# EAGLE design imu_junction (EAGLE 6.5.0)
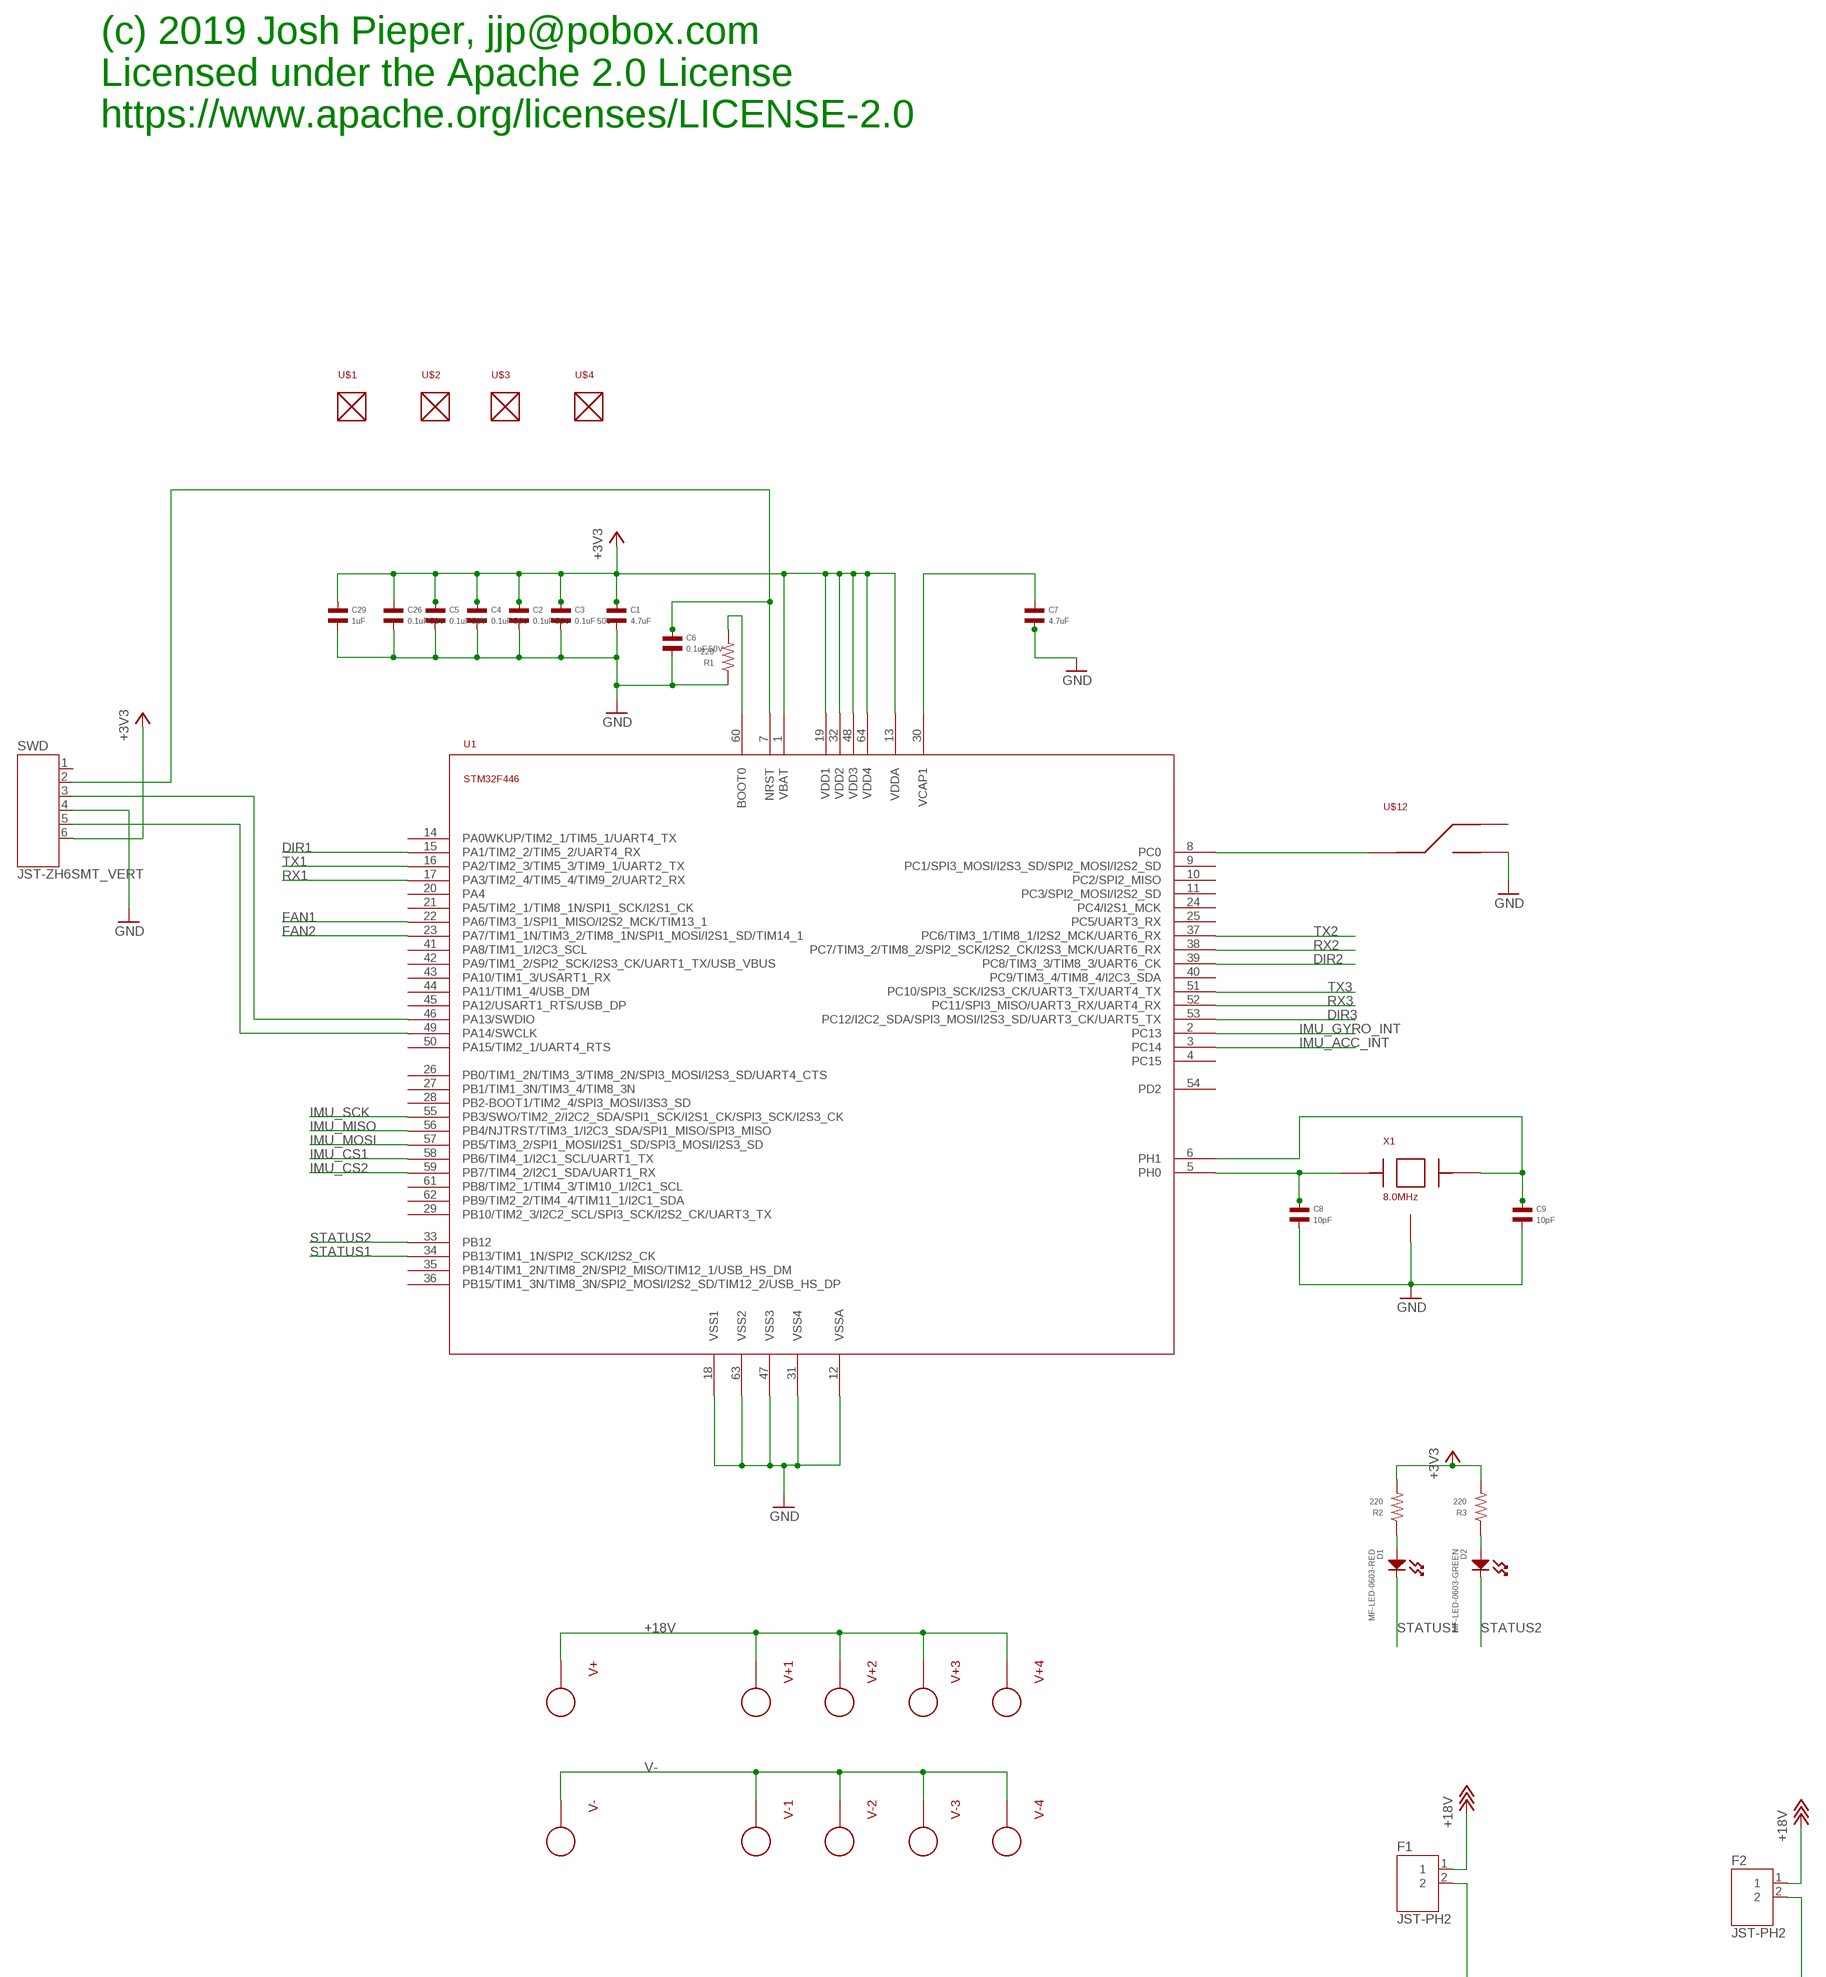
[diagram p0: schematic, sheet 1, part 1 of 2]
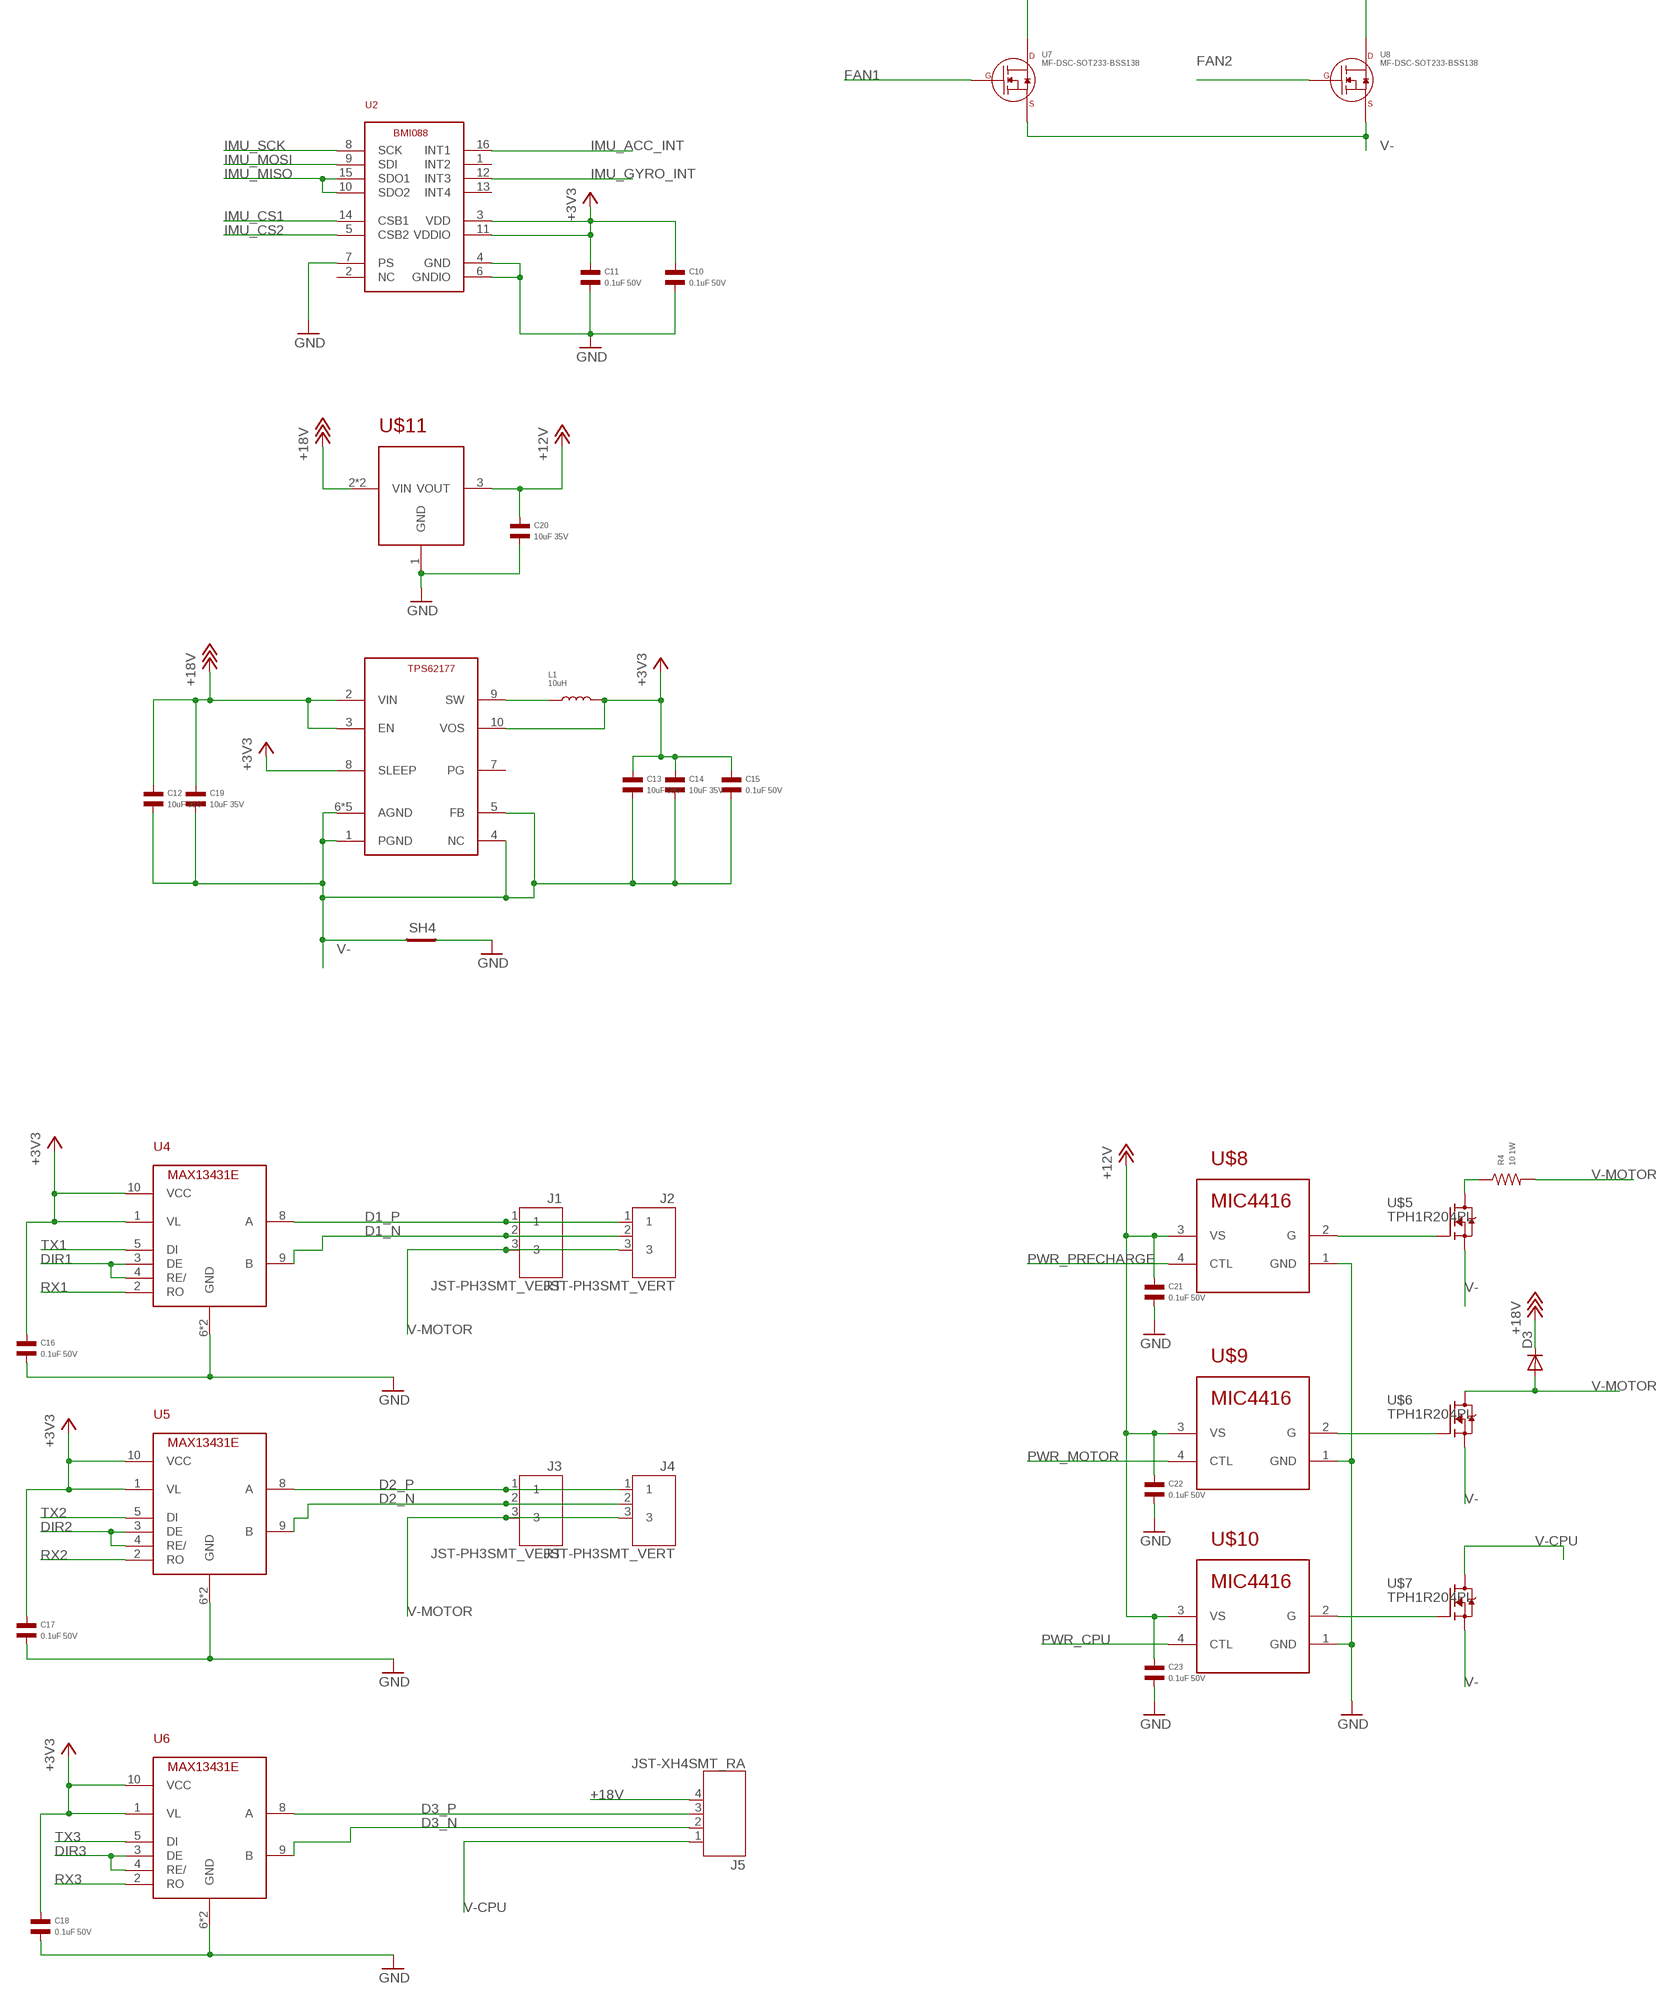
[diagram p1: schematic, sheet 1, part 2 of 2]

## Parts
C1  4.7uF  CAPACITOR_NP_0603  [C0603]
C2  0.1uF 50V  CAPACITOR_NP_0402  [C0402]
C3  0.1uF 50V  CAPACITOR_NP_0402  [C0402]
C4  0.1uF 50V  CAPACITOR_NP_0402  [C0402]
C5  0.1uF 50V  CAPACITOR_NP_0402  [C0402]
C6  0.1uF 50V  CAPACITOR_NP_0402  [C0402]
C7  4.7uF  CAPACITOR_NP_0603  [C0603]
C8  10pF  CAPACITOR_NP_0603  [C0603]
C9  10pF  CAPACITOR_NP_0603  [C0603]
C10  0.1uF 50V  CAPACITOR_NP_0402  [C0402]
C11  0.1uF 50V  CAPACITOR_NP_0402  [C0402]
C12  10uF 35V  CAPACITOR_NP_1206  [C1206]
C13  10uF 35V  CAPACITOR_NP_1206  [C1206]
C14  10uF 35V  CAPACITOR_NP_1206  [C1206]
C15  0.1uF 50V  CAPACITOR_NP_0402  [C0402]
C16  0.1uF 50V  CAPACITOR_NP_0402  [C0402]
C17  0.1uF 50V  CAPACITOR_NP_0402  [C0402]
C18  0.1uF 50V  CAPACITOR_NP_0402  [C0402]
C19  10uF 35V  CAPACITOR_NP_1206  [C1206]
C20  10uF 35V  CAPACITOR_NP_1206  [C1206]
C21  0.1uF 50V  CAPACITOR_NP_0402  [C0402]
C22  0.1uF 50V  CAPACITOR_NP_0402  [C0402]
C23  0.1uF 50V  CAPACITOR_NP_0402  [C0402]
C26  0.1uF 50V  CAPACITOR_NP_0402  [C0402]
C29  1uF  CAPACITOR_NP_0402  [C0402]
D1  MF-LED-0603-RED  LED_SINGLE-0603-RED  [LED0603]
D2  MF-LED-0603-GREEN  LED_SINGLE-0603-GREEN  [LED0603]
D3  DIODE-  [DO-214AB]
F1  JST-PH2  [JST_S2B-PH-SM4-TB(LF)(SN)]
F2  JST-PH2  [JST_S2B-PH-SM4-TB(LF)(SN)]
J1  JST-PH3SMT_VERT  [JST_B3B_PH-SM4-TB(LF)(SN)]
J2  JST-PH3SMT_VERT  [JST_B3B_PH-SM4-TB(LF)(SN)]
J3  JST-PH3SMT_VERT  [JST_B3B_PH-SM4-TB(LF)(SN)]
J4  JST-PH3SMT_VERT  [JST_B3B_PH-SM4-TB(LF)(SN)]
J5  JST-XH4SMT_RA  [JST_XH_SMT_RA_4]
L1  10uH  INDUCTOR_1210  [L1210]
R1  220  RESISTOR_0402  [R0402]
R2  220  RESISTOR_0402  [R0402]
R3  220  RESISTOR_0402  [R0402]
R4  10 1W  RESISTOR_1206  [R1206]
SH4  SHORTBIG  [SHORT_TOP-BIG]
SWD  JST-ZH6SMT_VERT  [JST_B6B-ZR-SM4-TF(LF)(SN)]
U1  STM32F4R_64PIN  [LQFP64]
U2  BMI088LGA16  [LGA16]
U3  TPS62177WSON10  [WSON10]
U4  MAX13431E  [TDFN10]
U5  MAX13431E  [TDFN10]
U6  MAX13431E  [TDFN10]
U7  MF-DSC-SOT233-BSS138  N-CHANNEL_FET_BSS138_SOT-23-3  [SOT-23-3]
U8  MF-DSC-SOT233-BSS138  N-CHANNEL_FET_BSS138_SOT-23-3  [SOT-23-3]
U$1  MOUNTM2  [M2MOUNT]
U$2  MOUNTM2  [M2MOUNT]
U$3  MOUNTM2  [M2MOUNT]
U$4  MOUNTM2  [M2MOUNT]
U$5  TPH1R204PL  [SOP_ADVANCE]
U$6  TPH1R204PL  [SOP_ADVANCE]
U$7  TPH1R204PL  [SOP_ADVANCE]
U$8  MIC4416  [SOT143]
U$9  MIC4416  [SOT143]
U$10  MIC4416  [SOT143]
U$11  ZXTR2012Z  [SOT89]
U$12  SLIDE_SWITCHJS_SUB_SWITCH  [JS_SUB_SWITCH]
V+  PAD12AWG_PAD  [12AWG_PAD]
V+1  PAD12AWG_PAD  [12AWG_PAD]
V+2  PAD12AWG_PAD  [12AWG_PAD]
V+3  PAD12AWG_PAD  [12AWG_PAD]
V+4  PAD12AWG_PAD  [12AWG_PAD]
V-  PAD12AWG_PAD  [12AWG_PAD]
V-1  PAD12AWG_PAD  [12AWG_PAD]
V-2  PAD12AWG_PAD  [12AWG_PAD]
V-3  PAD12AWG_PAD  [12AWG_PAD]
V-4  PAD12AWG_PAD  [12AWG_PAD]
X1  8.0MHz  CRYSTALABM3B  [ABM3B]

## Nets
+3V3: C1.P$1 C2.P$1 C3.P$1 C4.P$1 C5.P$1 C10.P$1 C11.P$1 C13.P$1 C14.P$1 C15.P$1 C16.P$1 C17.P$1 C18.P$1 C26.P$1 C29.P$1 L1.P$2 R2.P$2 R3.P$2 SWD.6 U1.1(VBAT) U1.13(VDDA) U1.19(VDD1) U1.32(VDD2) U1.48(VDD3) U1.64(VDD4) U2.3(VDD) U2.11(VDDIO) U3.8(SLEEP) U3.10(VOS) U4.1(VL) U4.10(VCC) U5.1(VL) U5.10(VCC) U6.1(VL) U6.10(VCC)
+12V: C20.P$1 C21.P$1 C22.P$1 C23.P$1 U$8.3(VS) U$9.3(VS) U$10.3(VS) U$11.3(VOUT)
+18V: C12.P$1 C19.P$1 D3.C F1.1 F2.1 J5.4 U3.2(VIN) U3.3(EN) U$11.2(VIN) U$11.PAD(VIN) V+1.1 V+2.1 V+3.1 V+4.1 V+.1
D1_N: J1.2 J2.2 U4.9(B)
D1_P: J1.1 J2.1 U4.8(A)
D2_N: J3.2 J4.2 U5.9(B)
D2_P: J3.1 J4.1 U5.8(A)
D3_N: J5.2 U6.9(B)
D3_P: J5.3 U6.8(A)
DIR1: U1.15(PA1/TIM2_2/TIM5_2/UART4_RX) U4.3(DE) U4.4(RE/)
DIR2: U1.39(PC8/TIM3_3/TIM8_3/UART6_CK) U5.3(DE) U5.4(RE/)
DIR3: U1.53(PC12/I2C2_SDA/SPI3_MOSI/I2S3_SD/UART3_CK/UART5_TX) U6.3(DE) U6.4(RE/)
FAN1: U1.22(PA6/TIM3_1/SPI1_MISO/I2S2_MCK/TIM13_1) U7.P$1(GATE)
FAN2: U1.23(PA7/TIM1_1N/TIM3_2/TIM8_1N/SPI1_MOSI/I2S1_SD/TIM14_1) U8.P$1(GATE)
GND: C1.P$2 C2.P$2 C3.P$2 C4.P$2 C5.P$2 C6.P$2 C7.P$2 C8.P$2 C9.P$2 C10.P$2 C11.P$2 C16.P$2 C17.P$2 C18.P$2 C20.P$2 C21.P$2 C22.P$2 C23.P$2 C26.P$2 C29.P$2 R1.P$1 SH4.2 SWD.4 U1.12(VSSA) U1.18(VSS1) U1.31(VSS4) U1.47(VSS3) U1.63(VSS2) U2.4(GND) U2.6(GNDIO) U2.7(PS) U4.6(GND) U4.PAD(GND) U5.6(GND) U5.PAD(GND) U6.6(GND) U6.PAD(GND) U$8.1(GND) U$9.1(GND) U$10.1(GND) U$11.1(GND) U$12.3 X1.2 X1.4
IMU_ACC_INT: U1.3(PC14) U2.16(INT1)
IMU_CS1: U1.58(PB6/TIM4_1/I2C1_SCL/UART1_TX) U2.14(CSB1)
IMU_CS2: U1.59(PB7/TIM4_2/I2C1_SDA/UART1_RX) U2.5(CSB2)
IMU_GYRO_INT: U1.2(PC13) U2.12(INT3)
IMU_MISO: U1.56(PB4/NJTRST/TIM3_1/I2C3_SDA/SPI1_MISO/SPI3_MISO) U2.10(SDO2) U2.15(SDO1)
IMU_MOSI: U1.57(PB5/TIM3_2/SPI1_MOSI/I2S1_SD/SPI3_MOSI/I2S3_SD) U2.9(SDI)
IMU_SCK: U1.55(PB3/SWO/TIM2_2/I2C2_SDA/SPI1_SCK/I2S1_CK/SPI3_SCK/I2S3_CK) U2.8(SCK)
N$1: L1.P$1 U3.9(SW)
N$2: U1.8(PC0) U$12.2
N$4: F1.2 U7.P$3(DRAIN)
N$5: D1.ANODE R2.P$1
N$6: SWD.5 U1.49(PA14/SWCLK)
N$7: SWD.3 U1.46(PA13/SWDIO)
N$8: D2.ANODE R3.P$1
N$9: F2.2 U8.P$3(DRAIN)
N$10: R4.P$1 U$5.5(D) U$5.6(D) U$5.7(D) U$5.8(D) U$5.PAD(D)
N$11: U$6.4(G) U$9.2(G)
N$12: U$5.4(G) U$8.2(G)
N$13: U$7.4(G) U$10.2(G)
N$23: C7.P$1 U1.30(VCAP1)
N$24: C6.P$1 SWD.2 U1.7(NRST)
N$33: R1.P$2 U1.60(BOOT0)
N$35: C8.P$1 U1.5(PH0) X1.1
N$36: C9.P$1 U1.6(PH1) X1.3
PWR_CPU: U$10.4(CTL)
PWR_MOTOR: U$9.4(CTL)
PWR_PRECHARGE: U$8.4(CTL)
RX1: U1.17(PA3/TIM2_4/TIM5_4/TIM9_2/UART2_RX) U4.2(RO)
RX2: U1.38(PC7/TIM3_2/TIM8_2/SPI2_SCK/I2S2_CK/I2S3_MCK/UART6_RX) U5.2(RO)
RX3: U1.52(PC11/SPI3_MISO/UART3_RX/UART4_RX) U6.2(RO)
STATUS1: D1.CATHODE U1.34(PB13/TIM1_1N/SPI2_SCK/I2S2_CK)
STATUS2: D2.CATHODE U1.33(PB12)
TX1: U1.16(PA2/TIM2_3/TIM5_3/TIM9_1/UART2_TX) U4.5(DI)
TX2: U1.37(PC6/TIM3_1/TIM8_1/I2S2_MCK/UART6_RX) U5.5(DI)
TX3: U1.51(PC10/SPI3_SCK/I2S3_CK/UART3_TX/UART4_TX) U6.5(DI)
V-: C12.P$2 C13.P$2 C14.P$2 C15.P$2 C19.P$2 SH4.1 U3.1(PGND) U3.4(NC) U3.5(FB) U3.6(AGND) U3.P0(AGND) U3.P1(AGND) U3.P2(AGND) U3.P3(AGND) U7.P$2(SOURCE) U8.P$2(SOURCE) U$5.1(S) U$5.2(S) U$5.3(S) U$6.1(S) U$6.2(S) U$6.3(S) U$7.1(S) U$7.2(S) U$7.3(S) V-1.1 V-2.1 V-3.1 V-4.1 V-.1
V-CPU: J5.1 U$7.5(D) U$7.6(D) U$7.7(D) U$7.8(D) U$7.PAD(D)
V-MOTOR: D3.A J1.3 J2.3 J3.3 J4.3 R4.P$2 U$6.5(D) U$6.6(D) U$6.7(D) U$6.8(D) U$6.PAD(D)
Unconnected: SWD.1 U1.4(PC15) U1.9(PC1/SPI3_MOSI/I2S3_SD/SPI2_MOSI/I2S2_SD) U1.10(PC2/SPI2_MISO) U1.11(PC3/SPI2_MOSI/I2S2_SD) U1.14(PA0WKUP/TIM2_1/TIM5_1/UART4_TX) U1.20(PA4) U1.21(PA5/TIM2_1/TIM8_1N/SPI1_SCK/I2S1_CK) U1.24(PC4/I2S1_MCK) U1.25(PC5/UART3_RX) U1.26(PB0/TIM1_2N/TIM3_3/TIM8_2N/SPI3_MOSI/I2S3_SD/UART4_CTS) U1.27(PB1/TIM1_3N/TIM3_4/TIM8_3N) U1.28(PB2-BOOT1/TIM2_4/SPI3_MOSI/I3S3_SD) U1.29(PB10/TIM2_3/I2C2_SCL/SPI3_SCK/I2S2_CK/UART3_TX) U1.35(PB14/TIM1_2N/TIM8_2N/SPI2_MISO/TIM12_1/USB_HS_DM) U1.36(PB15/TIM1_3N/TIM8_3N/SPI2_MOSI/I2S2_SD/TIM12_2/USB_HS_DP) U1.40(PC9/TIM3_4/TIM8_4/I2C3_SDA) U1.41(PA8/TIM1_1/I2C3_SCL) U1.42(PA9/TIM1_2/SPI2_SCK/I2S3_CK/UART1_TX/USB_VBUS) U1.43(PA10/TIM1_3/USART1_RX) U1.44(PA11/TIM1_4/USB_DM) U1.45(PA12/USART1_RTS/USB_DP) U1.50(PA15/TIM2_1/UART4_RTS) U1.54(PD2) U1.61(PB8/TIM2_1/TIM4_3/TIM10_1/I2C1_SCL) U1.62(PB9/TIM2_2/TIM4_4/TIM11_1/I2C1_SDA) U2.1(INT2) U2.2(NC) U2.13(INT4) U3.7(PG) U$12.1

## Notes on the sheet
- (c) 2019 Josh Pieper, jjp@pobox.com
  Licensed under the Apache 2.0 License
  https://www.apache.org/licenses/LICENSE-2.0

## Library data of the parts
C1 C7 = mfpassives:CAPACITOR_NP: Library: MF_Passives Description: Device for Non-Polarized Capacitors. Manufacture part number (MPN) can be added via Attributes. Check https://factory.macrofab.com/parts for the house parts list.; MF: Samsung Electro-Mechanics; MPN: CL10A475KA8NQNC; POPULATE: 1
C2-C6 C10 C11 C15-C18 C21-C23 C26 = mfpassives:CAPACITOR_NP: Library: MF_Passives Description: Device for Non-Polarized Capacitors. Manufacture part number (MPN) can be added via Attributes. Check https://factory.macrofab.com/parts for the house parts list.; MF: Walsin; MPN: 0402B104K500CT; POPULATE: 1
C8 C9 = mfpassives:CAPACITOR_NP: Library: MF_Passives Description: Device for Non-Polarized Capacitors. Manufacture part number (MPN) can be added via Attributes. Check https://factory.macrofab.com/parts for the house parts list.; HOUSEPART: 1; MPN: MF-CAP-0603-10pF; POPULATE: 1
C12-C14 C19 C20 = mfpassives:CAPACITOR_NP: Library: MF_Passives Description: Device for Non-Polarized Capacitors. Manufacture part number (MPN) can be added via Attributes. Check https://factory.macrofab.com/parts for the house parts list.; MF: TDK; MPN: CGA5L1X7R1V106K160AC; POPULATE: 1
C29 = mfpassives:CAPACITOR_NP: Library: MF_Passives Description: Device for Non-Polarized Capacitors. Manufacture part number (MPN) can be added via Attributes. Check https://factory.macrofab.com/parts for the house parts list.; HOUSEPART: YES; MPN: MF-CAP-0402-1uF; POPULATE: 1
D1 = mfleds:LED_SINGLE: Library: MF_LEDs Description: Device for Single LED Packages. Manufacture part number (MFG#) can be added via Attributes.; HOUSEPART: YES; MPN: MF-LED-0603-RED; POPULATE: 1; URL: https://factory.macrofab.com/part/MF-LED-0603-RED
D2 = mfleds:LED_SINGLE: Library: MF_LEDs Description: Device for Single LED Packages. Manufacture part number (MFG#) can be added via Attributes.; HOUSEPART: YES; MPN: MF-LED-0603-GREEN; POPULATE: 1; URL: https://factory.macrofab.com/part/MF-LED-0603-GREEN
D3 = imu_junction:DIODE-: DIODE
F1 F2 = imu_junction:JST-PH2; MF: JST; MPN: B2B-PH-SM4-TB(LF)(SN); POPULATE: 1
J1-J4 = controller:JST-PH3; MF: JST; MPN: B3B-PH-SM4-TB(LF)(SN); POPULATE: 1
J5 = gimbal:JST-XH4; DPN: 455-2262-1-ND; MPN: S4B-XH-SM4-TB(LF)(SN); POPULATE: 1
L1 = mfpassives:INDUCTOR: Library: MF_Passives Description: Device for Inductors. Manufacture part number (MPN) can be added via Attributes. Check https://factory.macrofab.com/parts for the house parts list.; HOUSEPART: 1; MPN: MF-IND-1210-10uH; POPULATE: 1
R1-R3 = mfpassives:RESISTOR: Library: MF_Passives Description: Device for Resistors. Manufacture part number (MPN), Voltage, Tolerance, and Wattage Rating can be added via Attributes. Check https://factory.macrofab.com/parts for the house parts list.; HOUSEPART: 1; MPN: MF-RES-0402-220; POPULATE: 1
R4 = mfpassives:RESISTOR: Library: MF_Passives Description: Device for Resistors. Manufacture part number (MPN), Voltage, Tolerance, and Wattage Rating can be added via Attributes. Check https://factory.macrofab.com/parts for the house parts list.; MF: Susumu; MPN: HRG3216Q-10R0-D-T1; POPULATE: 1
SH4 = shorts:SHORT: Short between two nets; POPULATE: 0
SWD = controller:JST-ZH6; MF: JST; MPN: B6B-ZR-SM4-TF(LF)(SN); POPULATE: 1
U1 = controller:STM32F4R_64PIN: 64-pin STM32F4 chip.; MF: ST; MPN: STM32F446RET6; POPULATE: 1
U2 = imu_junction:BMI088; MF: Bosch Sensortec; MPN: BMI088; POPULATE: 1
U3 = imu_junction:TPS62177; MF: TI; MPN: TPS62177DQCR; POPULATE: 1
U4-U6 = controller:MAX13431E; MF: Maxim; MPN: MAX13431EETB+T; POPULATE: 1
U7 U8 = mfdiscretesemi:N-CHANNEL_FET: Library: MF_Discrete_Semiconductor Description: Device for Single N-Channel Mosfet. Manufacture part number (MFG#) can be added via Attributes.; HOUSEPART: YES; MPN: MF-DSC-SOT233-BSS138; POPULATE: 1; URL: https://factory.macrofab.com/part/MF-DSC-SOT233-BSS138
U$1-U$4 = controller:MOUNT; POPULATE: 0
U$5-U$7 = imu_junction:TPH1R204PL; MF: Toshiba; MPN: TPH1R204PL; POPULATE: 1
U$8-U$10 = imu_junction:MIC4416; MF: MICROCHIP; MPN: MIC4416YM4-TR; POPULATE: 1
U$11 = imu_junction:ZXTR2012Z; MF: DIODES INC; MPN: ZXTR2012Z; POPULATE: 1
U$12 = imu_junction:SLIDE_SWITCH
V+ V+1-V+4 V- V-1-V-4 = controller:PAD; POPULATE: 0
X1 = controller:CRYSTAL; MF: Abracon; MPN: ABM3B-8.000MHZ-10-1-U-T; POPULATE: 1

## Board
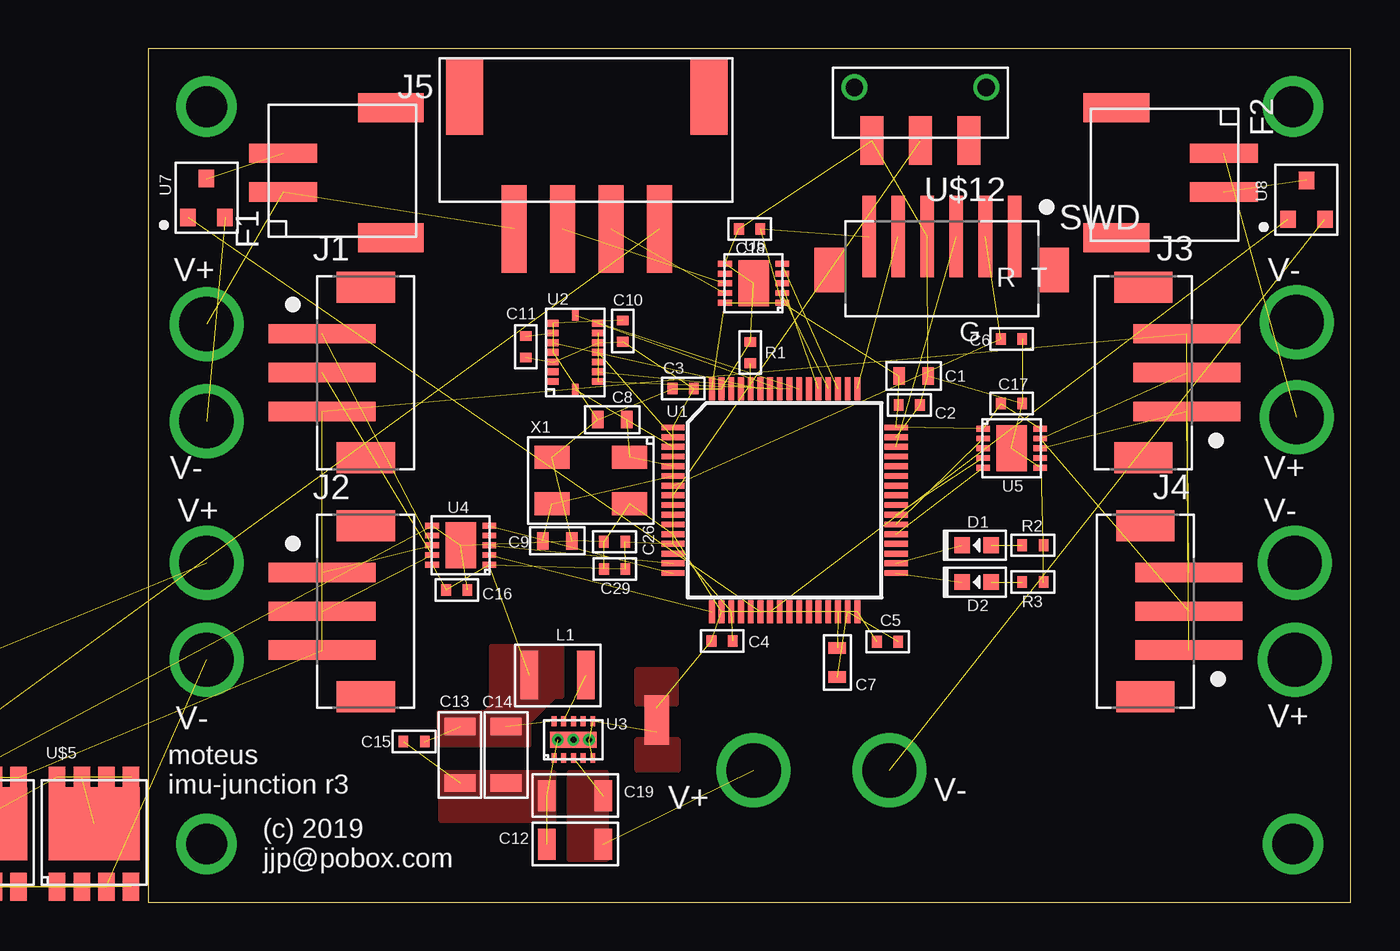
[diagram p2: board, top side]
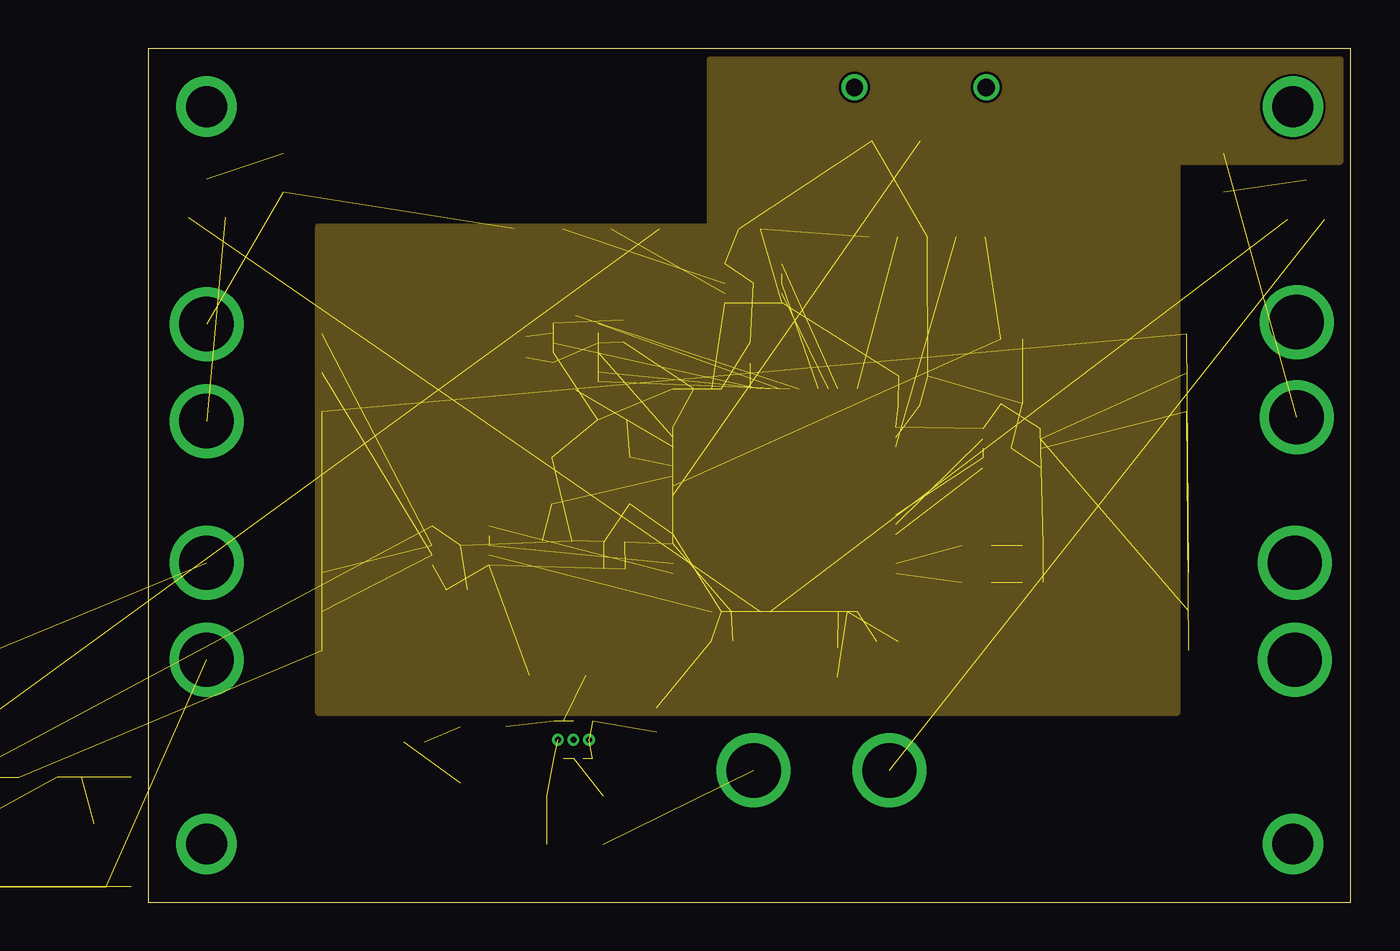
[diagram p3: board, inner layer Route2]
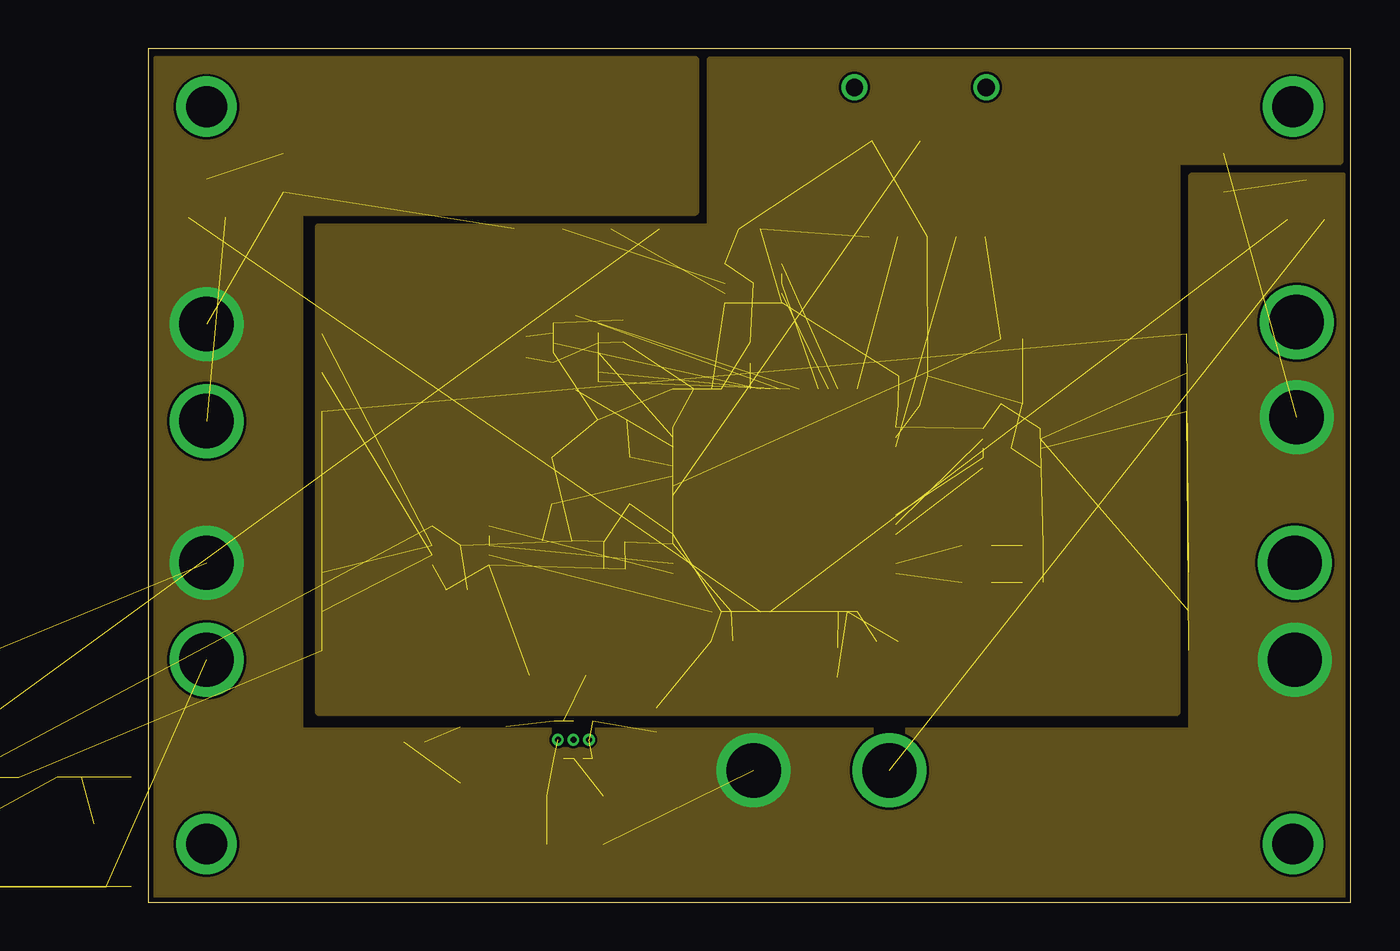
[diagram p4: board, inner layer Route15]

Size 62 x 44 mm. Coordinates in mm from the lower left corner, seen from the top.
Outline: 0,0 62,0 62,44 0,44 0,0
Copper layers (1*2*15*16): Top 0.035mm / dielectric 0.23mm / Route2 0.035mm / dielectric 0.93mm / Route15 0.035mm / dielectric 0.23mm / Bottom 0.035mm
Design rules "MF_Standard_4_Layer": minimum track width 5mil, minimum drill 12mil, track to track 5mil, track to pad 5mil, pad to pad 5mil, via to via 5mil, smd to smd 0mil, copper to edge 10mil, drill to drill 10mil, minimum pad ring 6mil, minimum via ring 6mil, stop-mask expansion 2mil, vias tented up to drill 25mil, thermal gap 10mil

### Footprints (pad centres in the part's own frame; a part is rotated, then mirrored left to right if it is on the bottom)
C0603 = smd 0.6 x 0.9: P$1 -0.75,0; P$2 0.75,0
C0402 = smd 0.5 x 0.6: P$1 -0.55,0; P$2 0.55,0
C1206 = smd 0.9 x 1.6: P$1 -1.45,0; P$2 1.45,0
LED0603 = smd 0.8 x 0.8: ANODE 0.75,0; CATHODE -0.75,0
DO-214AB = smd 1.778 x 5.08: A 3.302,0; C -3.302,0
JST_S2B-PH-SM4-TB(LF)(SN) = smd 1 x 3.5: 1 1,-2.65; 2 -1,-2.65 | smd 1.5 x 3.4: S1 -3.35,2.9; S2 3.35,2.9
JST_B3B_PH-SM4-TB(LF)(SN) = smd 1 x 5.5: 1 -2,-2.54; 2 0,-2.54; 3 2,-2.54 | smd 1.6 x 3: P1 -4.4,-0.29; P2 4.4,-0.29
JST_XH_SMT_RA_4 = smd 1.3 x 4.5: 1 -3.75,4.6; 2 -1.25,4.6; 3 1.25,4.6; 4 3.75,4.6 | smd 1.9 x 3.9: SHLD1 -6.3,-2.2; SHLD2 6.3,-2.2
L1210 = smd 0.9 x 2.5: P$1 -1.45,0; P$2 1.45,0
R0402 = smd 0.5 x 0.6: P$1 -0.55,0; P$2 0.55,0
R1206 = smd 0.9 x 1.6: P$1 -1.45,0; P$2 1.45,0
SHORT_TOP-BIG = smd 1.27 x 1.27: 1 0.635,0; 2 -0.635,0
JST_B6B-ZR-SM4-TF(LF)(SN) = smd 0.7 x 4.2: 1 -3.75,-2; 2 -2.25,-2; 3 -0.75,-2; 4 0.75,-2; 5 2.25,-2; 6 3.75,-2 | smd 1.5 x 2.3: P1 -5.8,-0.29; P2 5.8,-0.29
LQFP64 = smd 1.2 x 0.3: 1 -5.75,3.75; 2 -5.75,3.25; 3 -5.75,2.75; 4 -5.75,2.25; 5 -5.75,1.75; 6 -5.75,1.25; 7 -5.75,0.75; 8 -5.75,0.25; 9 -5.75,-0.25; 10 -5.75,-0.75; 11 -5.75,-1.25; 12 -5.75,-1.75; 13 -5.75,-2.25; 14 -5.75,-2.75; 15 -5.75,-3.25; 16 -5.75,-3.75; 33 5.75,-3.75; 34 5.75,-3.25; 35 5.75,-2.75; 36 5.75,-2.25; 37 5.75,-1.75; 38 5.75,-1.25; 39 5.75,-0.75; 40 5.75,-0.25; 41 5.75,0.25; 42 5.75,0.75; 43 5.75,1.25; 44 5.75,1.75; 45 5.75,2.25; 46 5.75,2.75; 47 5.75,3.25; 48 5.75,3.75 | smd 0.3 x 1.2: 17 -3.75,-5.75; 18 -3.25,-5.75; 19 -2.75,-5.75; 20 -2.25,-5.75; 21 -1.75,-5.75; 22 -1.25,-5.75; 23 -0.75,-5.75; 24 -0.25,-5.75; 25 0.25,-5.75; 26 0.75,-5.75; 27 1.25,-5.75; 28 1.75,-5.75; 29 2.25,-5.75; 30 2.75,-5.75; 31 3.25,-5.75; 32 3.75,-5.75; 49 3.75,5.75; 50 3.25,5.75; 51 2.75,5.75; 52 2.25,5.75; 53 1.75,5.75; 54 1.25,5.75; 55 0.75,5.75; 56 0.25,5.75; 57 -0.25,5.75; 58 -0.75,5.75; 59 -1.25,5.75; 60 -1.75,5.75; 61 -2.25,5.75; 62 -2.75,5.75; 63 -3.25,5.75; 64 -3.75,5.75
LGA16 = smd 0.35 x 0.575: 1 -1.5,1.16; 2 -1,1.16; 3 -0.5,1.16; 4 0,1.16; 5 0.5,1.16; 6 1,1.16; 7 1.5,1.16; 9 1.5,-1.16; 10 1,-1.16; 11 0.5,-1.16; 12 0,-1.16; 13 -0.5,-1.16; 14 -1,-1.16; 15 -1.5,-1.16 | smd 0.575 x 0.35: 8 1.915,0; 16 -1.915,0
WSON10 = smd 0.5 x 0.25: 1 -0.95,1; 2 -0.95,0.5; 3 -0.95,0; 4 -0.95,-0.5; 5 -0.95,-1; 6 0.95,-1; 7 0.95,-0.5; 8 0.95,0; 9 0.95,0.5; 10 0.95,1 | smd 0.84 x 2.4: P0 0,0 | drill 0.305: P1 0,0.8; P2 0,0; P3 0,-0.8
TDFN10 = smd 0.7 x 0.3: 1 -1.475,1; 2 -1.475,0.5; 3 -1.475,0; 4 -1.475,-0.5; 5 -1.475,-1; 6 1.475,-1; 7 1.475,-0.5; 8 1.475,0; 9 1.475,0.5; 10 1.475,1 | smd 1.58 x 2.35: PAD 0,0
SOT-23-3 = smd 0.9 x 0.8: P$1 -1,0.95; P$2 -1,-0.95; P$3 1,0
M2MOUNT = drill 2.1: P$1 0,0
SOP_ADVANCE = smd 0.85 x 1.45: 1 -1.905,-2.8; 2 -0.635,-2.8; 3 0.635,-2.8; 4 1.905,-2.8 | smd 0.85 x 1.05: 5 1.905,2.85; 6 0.635,2.85; 7 -0.635,2.85; 8 -1.905,2.85 | smd 4.7 x 3.75: PAD 0,0.45
SOT143 = smd 1.2 x 1.44: 1 -0.85,-1.1 | smd 1 x 1.44: 2 0.95,-1.1; 3 0.95,1.1; 4 -0.95,1.1
SOT89 = smd 0.58 x 1.73: 1 -1.5,-1.2; 3 1.5,-1.2 | smd 0.76 x 1.55: 2 0,-1.29 | smd 1.933 x 3.03: PAD 0,1
JS_SUB_SWITCH = smd 1.2 x 2.5: 1 -2.5,2.75; 2 0,2.75; 3 2.5,2.75 | drill 0.9: G0 -3.4,0; G1 3.4,0
12AWG_PAD = drill 2.8: 1 0,0
ABM3B = smd 1.8 x 1.2: 1 -2,-1.2; 2 2,-1.2; 3 2,1.2; 4 -2,1.2

### Placement (x,y rotation side)
C1  39.45,27.12 0 top
C2  39.23,25.62 0 top
C3  27.57,26.47 180 top
C4  29.58,13.47 180 top
C5  38.11,13.43 0 top
C6  44.5,29.03 0 top
C7  35.52,12.36 270 top
C8  23.91,24.87 180 top
C9  21.08,18.63 0 top
C10  24.46,29.44 90 top
C11  19.46,28.63 90 top
C12  22,3 180 top
C13  16.06,7.6 270 top
C14  18.44,7.6 270 top
C15  13.7,8.28 180 top
C16  15.9,16.1 0 top
C17  44.5,25.7 0 top
C18  31,34.7 180 top
C19  22,5.5 180 top
C20  -40.5,-10.1 0 top  (outside the outline)
C21  -41.6,-17.7 0 top  (outside the outline)
C22  -41.6,-21.3 0 top  (outside the outline)
C23  -41.6,-24.9 0 top  (outside the outline)
C26  24.03,18.58 180 top
C29  24.04,17.18 180 top
D1  42.7,18.4 0 top
D2  42.7,16.5 0 top
D3  -38.9,-4.2 0 top  (outside the outline)
F1  9.6,37.6 270 top
F2  52.8,37.6 90 top
J1  11.5,27.3 270 top
J2  11.5,15 270 top
J3  51,27.3 90 top
J4  51.1,15 90 top
J5  22.6,39.3 180 top
L1  21.1,11.71 180 top
R1  31.03,28.33 270 top
R2  45.6,18.4 0 top
R3  45.6,16.5 0 top
R4  -40.5,-14 0 top  (outside the outline)
SH4  26.2,9.4 270 top
SWD  40.9,32.3 180 top
U1  32.8,20.72 0 top
U2  22.01,28.34 90 top
U3  21.91,8.38 90 top
U4  16.1,18.4 180 top
U5  44.5,23.4 0 top
U6  31.2,31.9 180 top
U7  3,36.3 90 top
U8  59.7,36.2 90 top
U$1  59,41 0 top
U$2  59,3 0 top
U$3  3,41 0 top
U$4  3,3 0 top
U$5  -2.8,3.6 0 top
U$6  -8.6,3.6 0 top  (outside the outline)
U$7  -14.4,3.6 0 top  (outside the outline)
U$8  -19.4,1.9 0 top  (outside the outline)
U$9  -23.4,1.9 0 top  (outside the outline)
U$10  -27.4,1.9 0 top  (outside the outline)
U$11  -31.7,2.2 0 top  (outside the outline)
U$12  39.8,42 180 top
V+  31.2,6.8 0 top
V+1  3,29.8 0 top
V+2  3,17.5 0 top
V+3  59.2,25 0 top
V+4  59.1,12.5 0 top
V-  38.2,6.8 0 top
V-1  3,24.8 0 top
V-2  3,12.5 0 top
V-3  59.2,29.9 0 top
V-4  59.1,17.5 0 top
X1  22.81,21.74 180 top

### Tracks (layer width: path | path; a pad name or v marks a point on that pad's centre or on a via)
+3V3  (32 unrouted)
  pour Route15 (no thermals): 8.8,34.8 29,34.8 29,43.4 61.4,43.4 61.4,38.2 53,38.2 53,9.8 8.8,9.8
  pour Top (no thermals): 17.7,13.2 21.3,13.2 21.3,10.6 20.9,10.6 19.6,9.3 19.6,8.1 15,8.1 15,9.8 17.4,9.8 17.7,10.1
+12V  (7 unrouted)
+18V  (9 unrouted)
  pour Route15 (no thermals): 0.4,0.4 61.6,0.4 61.6,37.4 53.8,37.4 53.8,8.8 7.8,8.8 7.8,35.6 28.2,35.6 28.2,43.4 0.4,43.4
  pour Top (no thermals): 21.7,6.7 23.6,6.7 23.6,2.2 21.7,2.2
D1_N  (2 unrouted)
D1_P  (2 unrouted)
D2_N  (2 unrouted)
D2_P  (2 unrouted)
D3_N  (1 unrouted)
D3_P  (1 unrouted)
DIR1  (2 unrouted)
DIR2  (2 unrouted)
DIR3  (2 unrouted)
FAN1  (1 unrouted)
FAN2  (1 unrouted)
GND  (43 unrouted)
  pour Route2 (no thermals): 8.8,34.8 29,34.8 29,43.4 61.4,43.4 61.4,38.2 53,38.2 53,9.8 8.8,9.8
  pour Top (no thermals): 25.2,12 27.2,12 27.2,10.2 25.2,10.2
IMU_ACC_INT  (1 unrouted)
IMU_CS1  (1 unrouted)
IMU_CS2  (1 unrouted)
IMU_GYRO_INT  (1 unrouted)
IMU_MISO  (2 unrouted)
IMU_MOSI  (1 unrouted)
IMU_SCK  (1 unrouted)
N$1  (1 unrouted)
N$2  (1 unrouted)
N$4  (1 unrouted)
N$5  (1 unrouted)
N$6  (1 unrouted)
N$7  (1 unrouted)
N$8  (1 unrouted)
N$9  (1 unrouted)
N$10  (5 unrouted)
N$11  (1 unrouted)
N$12  (1 unrouted)
N$13  (1 unrouted)
N$23  (1 unrouted)
N$24  (2 unrouted)
N$33  (1 unrouted)
N$35  (2 unrouted)
N$36  (2 unrouted)
RX1  (1 unrouted)
RX2  (1 unrouted)
RX3  (1 unrouted)
STATUS1  (1 unrouted)
STATUS2  (1 unrouted)
TX1  (1 unrouted)
TX2  (1 unrouted)
TX3  (1 unrouted)
V-  (19 unrouted)
  pour Top (no thermals): 25.2,8.4 27.3,8.4 27.3,6.8 25.2,6.8
  pour Top (no thermals): 15.1,6.7 20.9,6.7 20.9,4.2 15.1,4.2
V-CPU  (5 unrouted)
V-MOTOR  (10 unrouted)

### Text on the board
tNames: V+ | R | T | V- | G | V- | V+ | V+ | V- | V- | V+ | moteus / imu-junction r3 | V+ | V- | (c) 2019 / jjp@pobox.com